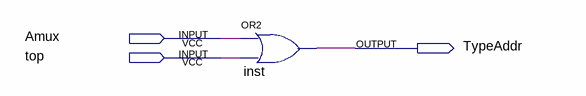
[diagram p0: schematic sheet]
// Quartus schematic AddrTypeSelector.bdf as structural Verilog: 1 symbols, 3 pins
module AddrTypeSelector (
  input  Amux,
  input  top,
  output TypeAddr
);

  or inst (TypeAddr, Amux, top);
endmodule
